# EAGLE design radio (EAGLE 6.4)
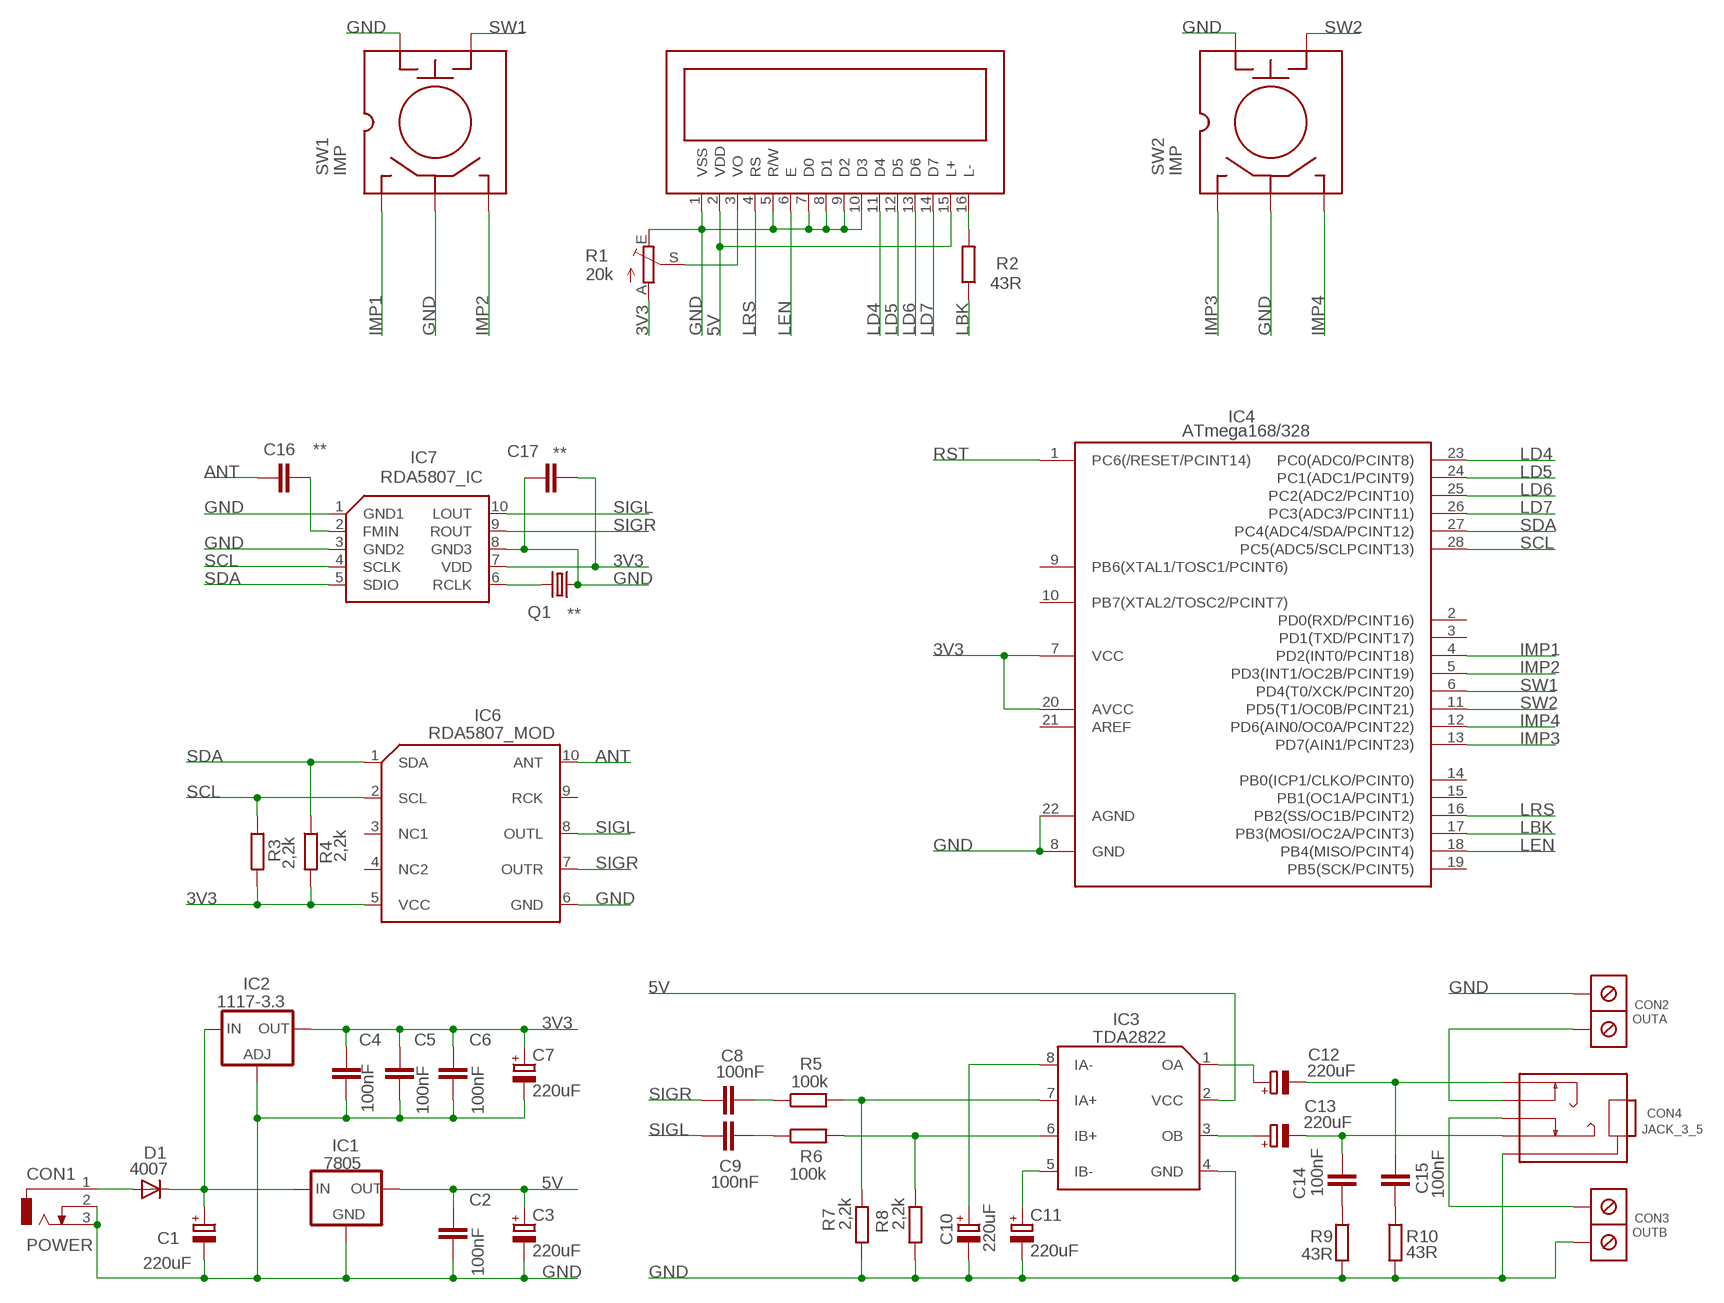
[diagram p0: schematic, sheet 1]

## Parts
C1  220uF  CPOL-EUE2.5-7  [E2,5-7]
C2  100nF  C-EU050-030X075  [C050-030X075]
C3  220uF  CPOL-EUE2.5-7  [E2,5-7]
C4  100nF  C-EU050-030X075  [C050-030X075]
C5  100nF  C-EU050-030X075  [C050-030X075]
C6  100nF  C-EU050-030X075  [C050-030X075]
C7  220uF  CPOL-EUE2.5-7  [E2,5-7]
C8  100nF  C-EU050-030X075  [C050-030X075]
C9  100nF  C-EU050-030X075  [C050-030X075]
C10  220uF  CPOL-EUE2.5-7  [E2,5-7]
C11  220uF  CPOL-EUE2.5-7  [E2,5-7]
C12  220uF  CPOL-EUE2.5-7  [E2,5-7]
C13  220uF  CPOL-EUE2.5-7  [E2,5-7]
C14  100nF  C-EU050-030X075  [C050-030X075]
C15  100nF  C-EU050-030X075  [C050-030X075]
C16  **  C-EUC0805K  [C0805K]
C17  **  C-EUC0805K  [C0805K]
CON1  POWER  DCJ0202  [DCJ0202]
CON2  OUTA  ARK2/300  [ARK2/300]
CON3  OUTB  ARK2/300  [ARK2/300]
CON4  JACK_3_5  [JACK_3_5]
D1  4007  1N4004  [DO41-10]
IC1  7805  78XXS  [78XXS]
IC2  1117-3.3  LM317TS  [317TS]
IC3  TDA2822  [DIL8]
IC4  ATmega168/328  MEGA48/88/168-PU  [DIL28-3]
IC5  LCD16X2  [LCD16X2]
IC6  RDA5807_MOD  [RDA5807_MOD]
IC7  RDA5807_IC  [MSOP10]
Q1  **  CRYSTALTC38H  [TC38H]
R1  20k  TRIM_EU-CA6V  [CA6V]
R2  43R  R-EU_0207/7  [0207/7]
R3  2,2k  R-EU_0207/7  [0207/7]
R4  2,2k  R-EU_0207/7  [0207/7]
R5  100k  R-EU_0207/7  [0207/7]
R6  100k  R-EU_0207/7  [0207/7]
R7  2,2k  R-EU_0207/7  [0207/7]
R8  2,2k  R-EU_0207/7  [0207/7]
R9  43R  R-EU_0207/7  [0207/7]
R10  43R  R-EU_0207/7  [0207/7]
SW1  IMP  [IMP]
SW2  IMP  [IMP]

## Nets
3V3: C4.1 C5.1 C6.1 C7.+ C17.2 IC2.2(OUT) IC4.7(VCC) IC4.20(AVCC) IC6.5(VCC) IC7.7(VDD) R1.A R3.2 R4.2
5V: C2.1 C3.+ IC1.OUT IC3.2(VCC) IC5.2(VDD) IC5.15(L+)
ANT: C16.1 IC6.10(ANT)
GND: C1.- C2.2 C3.- C4.2 C5.2 C6.2 C7.- C10.- C11.- C17.1 CON1.2 CON1.3 CON2.2 CON3.1 CON4.G IC1.GND IC2.1(ADJ) IC3.4(GND) IC4.8(GND) IC4.22(AGND) IC5.1(VSS) IC5.5(R/W) IC5.7(D0) IC5.8(D1) IC5.9(D2) IC5.10(D3) IC6.6(GND) IC7.1(GND1) IC7.3(GND2) IC7.8(GND3) Q1.1 R1.E R7.2 R8.2 R9.2 R10.2 SW1.2 SW1.5 SW2.2 SW2.5
HL: C13.- C14.2 CON4.L
HR: C12.- C15.2 CON4.R
IMP1: IC4.4(PD2(INT0/PCINT18)) SW1.1
IMP2: IC4.5(PD3(INT1/OC2B/PCINT19)) SW1.3
IMP3: IC4.13(PD7(AIN1/PCINT23)) SW2.1
IMP4: IC4.12(PD6(AIN0/OC0A/PCINT22)) SW2.3
LBK: IC4.17(PB3(MOSI/OC2A/PCINT3)) R2.1
LD4: IC4.23(PC0(ADC0/PCINT8)) IC5.11(D4)
LD5: IC4.24(PC1(ADC1/PCINT9)) IC5.12(D5)
LD6: IC4.25(PC2(ADC2/PCINT10)) IC5.13(D6)
LD7: IC4.26(PC3(ADC3/PCINT11)) IC5.14(D7)
LEN: IC4.18(PB4(MISO/PCINT4)) IC5.6(E)
LRS: IC4.16(PB2(SS/OC1B/PCINT2)) IC5.4(RS)
N$1: C14.1 R9.1
N$2: C15.1 R10.1
N$3: IC5.3(VO) R1.S
N$4: CON2.1 CON4.RW
N$5: C12.+ IC3.1(OA)
N$6: IC3.7(IA+) R5.2 R7.1
N$7: IC3.6(IB+) R6.2 R8.1
N$8: C11.+ IC3.5(IB-)
N$9: C10.+ IC3.8(IA-)
N$10: CON3.2 CON4.LW
N$12: C9.2 R6.1
N$13: C8.2 R5.1
N$14: C13.+ IC3.3(OB)
N$15: C1.+ D1.C IC1.IN IC2.3(IN)
N$16: IC7.6(RCLK) Q1.2
N$17: CON1.1 D1.A
N$27: C16.2 IC7.2(FMIN)
N$57: IC5.16(L-) R2.2
RST: IC4.1(PC6(/RESET/PCINT14))
SCL: IC4.28(PC5(ADC5/SCLPCINT13)) IC6.2(SCL) IC7.4(SCLK) R3.1
SDA: IC4.27(PC4(ADC4/SDA/PCINT12)) IC6.1(SDA) IC7.5(SDIO) R4.1
SIGL: C9.1 IC6.8(OUTL) IC7.10(LOUT)
SIGR: C8.1 IC6.7(OUTR) IC7.9(ROUT)
SW1: IC4.6(PD4(T0/XCK/PCINT20)) SW1.4
SW2: IC4.11(PD5(T1/OC0B/PCINT21)) SW2.4
Unconnected: IC4.2(PD0(RXD/PCINT16)) IC4.3(PD1(TXD/PCINT17)) IC4.9(PB6(XTAL1/TOSC1/PCINT6)) IC4.10(PB7(XTAL2/TOSC2/PCINT7)) IC4.14(PB0(ICP1/CLKO/PCINT0)) IC4.15(PB1(OC1A/PCINT1)) IC4.19(PB5(SCK/PCINT5)) IC4.21(AREF) IC6.3(NC1) IC6.4(NC2) IC6.9(RCK)

## Library data of the parts
C1 C3 C7 C10-C13 = rcl:CPOL-EU: POLARIZED CAPACITOR, European symbol
C2 C4-C6 C8 C9 C14-C17 = rcl:C-EU: CAPACITOR, European symbol
CON1 = con-jack:DCJ0202: DC POWER JACK Source: DCJ0202.pdf; OC_FARNELL: unknown; OC_NEWARK: unknown
CON2 CON3 = ds_lib_eagle:ARK2/300
CON4 = Jacki:JACK_3_5
D1 = diode:1N4004: DIODE general purpose rectifier, 1 A
IC1 = v-reg:78XXS: VOLTAGE REGULATOR
IC2 = v-reg:LM317TS: VOLTAGE REGULATOR
IC3 = tda2822:TDA2822
IC4 = avr-7:MEGA48/88/168-PU
IC5 = dslib_eagle 9:LCD16X2
IC6 = radio:RDA5807_MOD
IC7 = radio:RDA5807_IC
Q1 = crystal:CRYSTAL: CRYSTAL; OC_FARNELL: unknown; OC_NEWARK: unknown
R1 = pot:TRIM_EU-: POTENTIOMETER
R2-R10 = rcl:R-EU_: RESISTOR, European symbol
SW1 SW2 = dslib_eagle 9:IMP

## Board
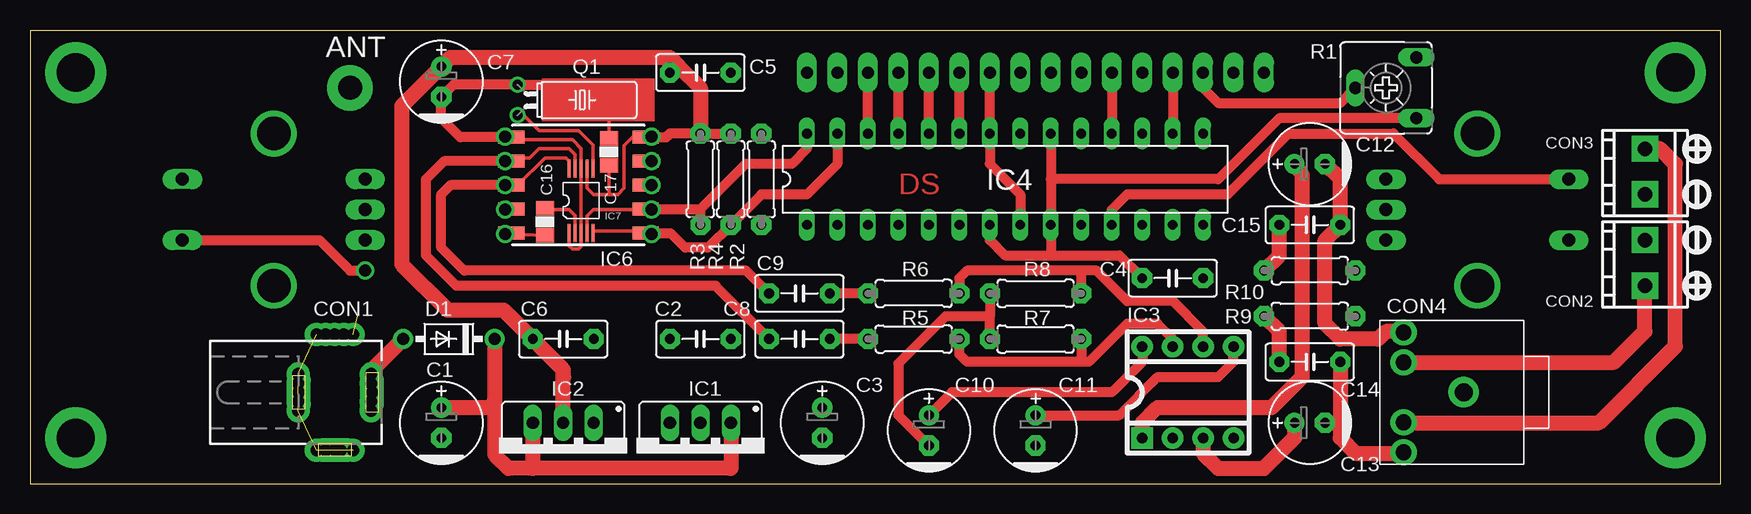
[diagram p1: board, top side]
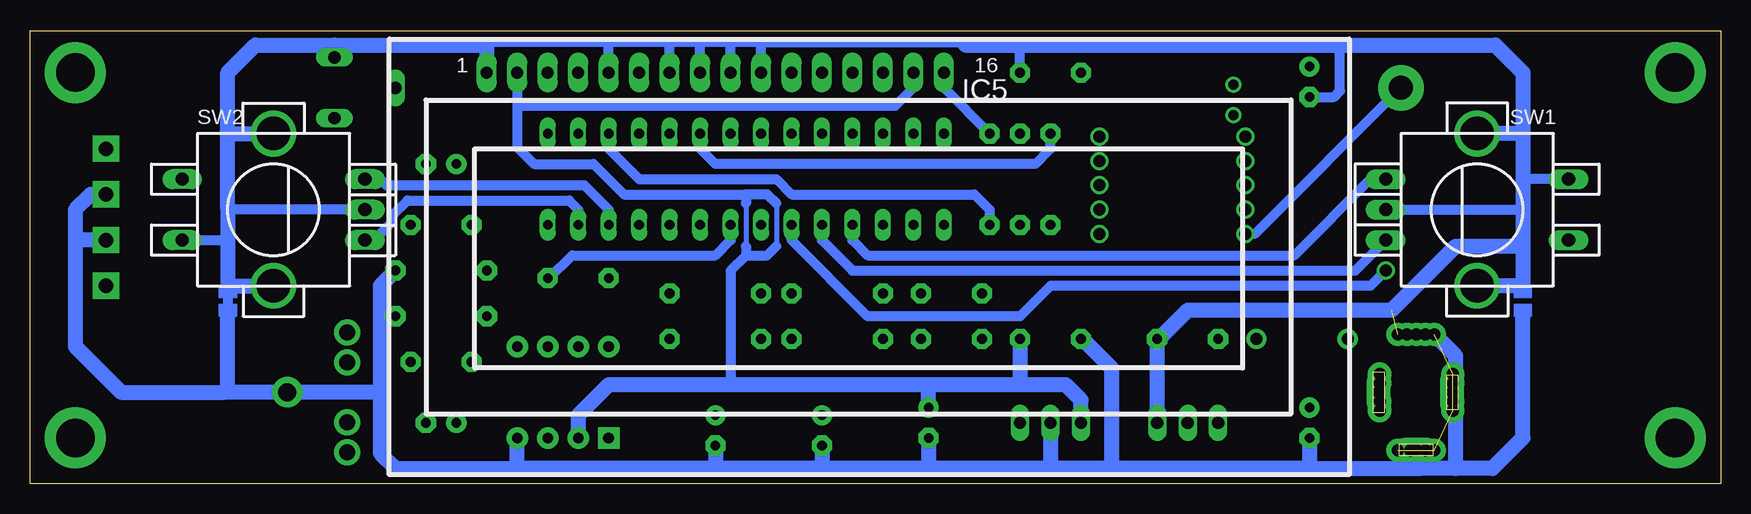
[diagram p2: board, bottom side, seen from below]

Size 140.95 x 37.77 mm. Coordinates in mm from the lower left corner, seen from the top.
Outline: 0,0 140.95,0 140.95,37.77 0,37.77 0,0
Copper layers (1*16): Top 0.035mm / dielectric 1.5mm / Bottom 0.035mm
Design rules "default": minimum track width 10mil, minimum drill 24mil, track to track 8mil, track to pad 8mil, pad to pad 8mil, via to via 8mil, smd to smd 8mil, copper to edge 40mil, drill to drill 8mil, minimum pad ring 10mil, minimum via ring 8mil, stop-mask expansion 4mil, vias tented up to drill 0mil, thermal gap 10mil

### Footprints (pad centres in the part's own frame; a part is rotated, then mirrored left to right if it is on the bottom)
E2,5-7 = drill 0.813 pad 1.676: + -1.27,0 | drill 0.813 pad 1.676 octagon: - 1.27,0
C050-030X075 = drill 0.813 pad 1.676 octagon: 1 -2.54,0; 2 2.54,0
C0805K = smd 1.219 x 1.499: 1 -1.127,0; 2 1.127,0
DCJ0202 = drill 1 pad 2 long: 1 0,3.1; 2 4.8,0; 3 0,-3
ARK2/300 = drill 1.2 pad 2.184 square: 1 -2.54,0; 2 1.27,0
JACK_3_5 = drill 1.5 pad 2.54: G -1.4,0 | drill 1.3 pad 2.2: L 3.6,5; LW 3.6,2.5; R 3.6,-5; RW 3.6,-2.5
DO41-10 = drill 1 pad 1.676: A 3.81,0; C -3.81,0
78XXS = drill 1.016 long: GND 0,-2.54; IN -2.54,-2.54; OUT 2.54,-2.54
317TS = drill 1.016 long: 1 -2.54,-2.54; 2 0,-2.54; 3 2.54,-2.54
DIL8 = drill 0.9 pad 1.778 square: 1 -3.81,-3.81 | drill 0.9 pad 1.778: 2 -1.27,-3.81; 3 1.27,-3.81; 4 3.81,-3.81; 5 3.81,3.81; 6 1.27,3.81; 7 -1.27,3.81; 8 -3.81,3.81
DIL28-3 = drill 0.813 long: 1 -16.51,-3.81; 2 -13.97,-3.81; 3 -11.43,-3.81; 4 -8.89,-3.81; 5 -6.35,-3.81; 6 -3.81,-3.81; 7 -1.27,-3.81; 8 1.27,-3.81; 9 3.81,-3.81; 10 6.35,-3.81; 11 8.89,-3.81; 12 11.43,-3.81; 13 13.97,-3.81; 14 16.51,-3.81; 15 16.51,3.81; 16 13.97,3.81; 17 11.43,3.81; 18 8.89,3.81; 19 6.35,3.81; 20 3.81,3.81; 21 1.27,3.81; 22 -1.27,3.81; 23 -3.81,3.81; 24 -6.35,3.81; 25 -8.89,3.81; 26 -11.43,3.81; 27 -13.97,3.81; 28 -16.51,3.81
LCD16X2 = drill 1 pad 1.676 long: 1 -15.24,6.35; 2 -12.7,6.35; 3 -10.16,6.35; 4 -7.62,6.35; 5 -5.08,6.35; 6 -2.54,6.35; 7 0,6.35; 8 2.54,6.35; 9 5.08,6.35; 10 7.62,6.35; 11 10.16,6.35; 12 12.7,6.35; 13 15.24,6.35; 14 17.78,6.35; 15 20.32,6.35; 16 22.86,6.35
RDA5807_MOD = smd 2.184 x 1.067: 1 -5.6,4.5; 2 -5.6,2.5; 3 -5.6,0.5; 4 -5.6,-1.5; 5 -5.6,-3.5; 6 5.6,-3.5; 7 5.6,-1.5; 8 5.6,0.5; 9 5.6,2.5; 10 5.6,4.5
MSOP10 = smd 0.25 x 1.5: 1 -0.77,-2.47; 2 -0.27,-2.47; 3 0.23,-2.47; 4 0.73,-2.47; 5 1.23,-2.47; 6 1.23,2.93; 7 0.73,2.93; 8 0.23,2.93; 9 -0.27,2.93; 10 -0.77,2.93
TC38H = drill 0.813: 1 -1.27,0; 2 1.27,0
CA6V = drill 1.016 long: A -2.54,-2.54; E 2.54,-2.54; S 0,2.54
0207/7 = drill 0.813 pad 1.676 octagon: 1 -3.81,0; 2 3.81,0
IMP = drill 1.1 long: 1 -2.54,-7.62; 2 0,-7.62; 3 2.54,-7.62; 4 2.54,7.62; 5 -2.54,7.62 | drill 2.8: P$6 -6.35,0; P$7 6.35,0

### Placement (x,y rotation side)
C1  34.29,5.08 270 top
C2  55.88,12.06 180 top
C3  66.04,5.08 270 top
C4  95.25,17.14 0 top
C5  55.88,34.29 0 top
C6  44.45,12.06 0 top
C7  34.29,33.53 270 top
C8  64.14,12.06 0 top
C9  64.14,15.87 0 top
C10  74.93,4.45 270 top
C11  83.82,4.45 270 top
C12  106.68,26.67 0 top
C13  106.68,5.08 0 top
C14  106.68,10.16 0 top
C15  106.68,21.59 0 top
C16  42.93,21.84 90 top
C17  48.26,27.69 270 top
CON1  25.4,7.62 270 top
CON2  134.62,19.05 90 top
CON3  134.62,26.67 90 top
CON4  118.11,7.62 180 top
D1  34.92,12.06 180 top
IC1  55.88,2.54 180 top
IC2  44.45,2.54 180 top
IC3  96.52,7.62 0 top
IC4  81.28,25.4 0 top
IC5  87.63,27.94 0 bottom
IC6  45.72,25.4 180 top
IC7  45.72,23.37 0 top
Q1  40.64,32 270 top
R1  113.03,33.02 90 top
R2  60.96,25.4 90 top
R3  55.88,25.4 90 top
R4  58.42,25.4 90 top
R5  73.66,12.06 0 top
R6  73.66,15.87 0 top
R7  83.82,12.06 180 top
R8  83.82,15.87 180 top
R9  106.68,13.97 0 top
R10  106.68,17.78 0 top
SW1  20.32,22.86 270 bottom
SW2  120.65,22.86 90 bottom

### Tracks (layer width: path | path; a pad name or v marks a point on that pad's centre or on a via)
3V3
  Top 0.305: IC7.7 46.45,24.67 46.99,24.13 48.26,24.13 | 51.26,28.96 IC6.5 50.24,28.9 49.53,28.19 49.53,24.64 49.02,24.13 48.26,24.13 | C17.2 48.26,24.13
  Top 0.813: C4.1 90.8,19.05 85.09,19.05 | IC4.20 85.09,25.4 | R1.A 104.14,30.48 99.06,25.4 85.09,25.4 | IC6.5 53.03,28.9 53.34,29.21 R3.2 R4.2 | 44.7,8.89 44.45,9.14 | IC4.7 80.01,20.32 81.28,19.05 85.09,19.05 | 85.09,25.4 85.09,19.05
  Top 1.27: IC2.2 44.45,9.14 44.45,9.53 C6.1 39.5,14.48 34.8,14.48 30.99,18.29 30.99,31.5 C7.+ 35.05,35.56 53.34,35.56 54.1,34.8 | 54.1,34.8 53.34,34.8 C5.1 | 54.1,34.8 55.88,33.02 R3.2
  Bottom 0.813: IC4.20 85.09,27.94 83.82,26.67 57.15,26.67 55.88,27.94 R3.2
5V
  Bottom 0.406: 78.74,23.37 78.74,19.81 | 81.28,23.37 81.28,19.81
  Bottom 0.813: IC5.2 100.33,31.5 | 100.33,31.5 100.33,28.07 98.93,26.67 93.98,26.67 91.44,24.13 81.28,24.13 | 78.74,23.37 79.5,24.13 81.28,24.13 | 81.28,24.13 81.28,23.37 | 81.28,19.81 81.28,19.05 | 81.28,19.05 82.55,17.78 82.55,8.25 | 81.28,19.05 79.5,19.05 78.74,19.81 | IC5.15 67.31,33.02 68.83,31.5 100.33,31.5
  Bottom 1.27: IC1.OUT 53.34,6.98 54.61,8.25 58.42,8.25 | 58.42,8.25 66.04,8.25 | 66.04,8.25 82.55,8.25 92.71,8.25 95.25,5.71 IC3.2 | C3.+ 66.04,8.25 | C2.1 58.42,8.25
ANT  (via drill 1, 2 pad 3.81)
  Top 0.305: 39.81,21.08 39.62,20.9 | C16.1 40.18,20.84 IC6.10
  Top 0.813: IC6.10 39.62,20.9 39.55,20.83 v39.62,20.83
  Bottom 0.813: v26.67,33.02 38.86,20.83 v39.62,20.83
GND  (1 unrouted)
  Top 0.305: IC6.6 40.32,28.7 45.21,28.7 45.95,27.96 IC7.8 IC7.3 45.95,19.79 45.72,19.56 45.21,19.56 44.95,19.82 IC7.1 | C17.1 48.26,33.27
  Top 0.813: IC5.10 IC4.22 80.01,26.67 82.55,24.13 IC4.8 | R7.2 80.01,13.97 | 80.01,13.97 76.33,13.97 72.39,10.03 72.39,5.71 C10.- | R8.2 80.01,13.97 | IC6.6 35.87,28.9 34.29,30.48 C7.- 35.31,33.27 Q1.1 48.26,33.27
  Bottom 0.813: 80.01,36.83 82.55,36.83 | 82.55,36.83 85.09,36.83 | 85.09,36.83 87.63,36.83 | 87.63,36.83 92.71,36.83 | 92.71,36.83 102.87,36.83 102.87,36.58 | IC5.5 92.71,36.83 | IC5.9 82.55,36.83 | IC5.8 85.09,36.83 | IC5.7 87.63,36.83 | IC5.10 80.01,36.83 | 80.01,36.83 62.99,36.83 62.99,36.58 | SW2.2 124.46,22.86 | R1.E 115.57,36.58 | SW1.5 16.51,25.4 | SW1.2 16.51,22.86 | SW2.5 124.46,20.32 | C5.2 58.42,36.32 58.67,36.58 | C4.2 97.66,17.14 95.76,19.05 83.82,19.05 82.55,20.32 IC4.8 | C7.- 32.26,32.26 31.75,32.77 31.75,36.32 32,36.58
  Bottom 1.27: 34.29,1.27 50.8,1.27 | 50.8,1.27 55.88,1.27 | 55.88,1.27 66.04,1.27 | 66.04,1.27 74.93,1.27 | 74.93,1.27 83.82,1.27 | 83.82,1.27 100.33,1.27 | 100.33,1.27 IC3.4 | C10.- 74.93,1.27 | C3.- 66.04,1.27 | C1.- 34.29,1.27 | 34.29,1.27 25.4,1.27 25.4,1.52 | CON1.2 25.4,1.52 | IC1.GND 55.88,1.27 | 100.33,1.27 110.49,1.27 111.76,2.54 111.76,7.62 | R9.2 111.76,13.97 | 111.76,13.97 111.76,7.62 | R10.2 111.76,16.51 111.76,13.97 | 83.82,3.3 C11.- 83.82,1.27 | 22.1,1.27 22.1,7.62 | 22.1,7.62 22.1,10.67 23.88,12.45 26.92,12.45 | CON1.3 22.1,7.62 | IC5.1 102.87,36.58 115.57,36.58 122.17,36.58 124.46,34.29 124.46,29.21 | 124.46,29.21 124.46,22.86 124.46,20.32 124.46,16.51 121.92,16.51 | CON2.2 136.91,20.32 | 136.91,20.32 137.16,20.32 137.16,11.43 133.35,7.62 124.71,7.62 124.46,7.87 | CON3.1 135.89,24.13 137.16,22.86 137.16,20.57 136.91,20.32 | 62.99,36.58 58.67,36.58 32,36.58 18.8,36.58 16.51,34.29 16.51,29.21 | 16.51,29.21 16.51,25.4 16.51,22.86 16.51,20.07 | 22.1,1.27 19.05,1.27 16.51,3.81 16.51,13.97 | 22.1,1.27 25.15,1.27 25.4,1.52 | C2.2 53.21,12.06 50.8,9.65 50.8,1.27 | 111.76,7.62 CON4.G | CON4.G 124.46,7.62 124.46,7.87 | 124.46,7.87 124.46,13.97 | 119.38,7.49 CON4.G | 16.51,20.07 16.51,16.51 19.05,16.51 | IC2.1 C6.2 46.86,12.06 44.45,14.48 27.43,14.48 22.1,19.81 16.76,19.81 16.51,20.07 | 16.51,29.21 18.8,29.21 | 124.46,29.21 121.92,29.21
HL
  Top 1.27: C14.2 109.22,5.08 | 109.22,5.08 109.22,3.81 110.49,2.54 114.43,2.54 CON4.L | C13.- 109.22,5.08
HR
  Top 1.27: C12.- 109.22,25.4 C15.2 107.95,20.32 107.95,13.33 109.22,12.06 112.39,12.06 113.03,12.7 114.43,12.7 CON4.R
IMP1
  Bottom 0.813: IC4.4 72.39,20.32 71.12,19.05 35.56,19.05 29.21,25.4 SW1.1
IMP2
  Bottom 0.813: IC4.5 74.93,20.32 72.39,17.78 30.48,17.78 SW1.3
IMP3
  Bottom 0.813: SW2.1 112.27,20.32 110.74,21.84 110.74,22.35 109.47,23.62 96.01,23.62 95.25,22.86 IC4.13
IMP4
  Bottom 0.813: SW2.3 111.76,25.4 111.25,24.89 94.74,24.89 92.71,22.86 IC4.12
LBK
  Bottom 0.813: IC4.17 92.71,27.94 90.17,25.4 78.74,25.4 77.47,24.13 62.23,24.13 60.96,22.86 R2.1
LD4
  Top 0.813: IC4.23 IC5.11
LD5
  Top 0.813: IC4.24 IC5.12
LD6
  Top 0.813: IC4.25 IC5.13
LD7
  Top 0.813: IC4.26 IC5.14
LEN
  Top 0.813: IC5.6 IC4.18
LRS
  Top 0.813: IC5.4 IC4.16
N$1
  Top 1.27: C14.1 104.14,12.7 R9.1
N$2
  Top 1.27: R10.1 104.14,19.05 C15.1
N$3
  Top 0.813: IC5.3 97.79,33.02 99.06,31.75 109.22,31.75 R1.S
N$4
  Top 1.27: CON4.RW 132.04,10.12 134.62,12.7 CON2.1
N$5
  Top 1.27: C12.+ 106.05,25.78 106.05,8.89 103.5,6.35 93.98,6.35 92.71,5.08 IC3.1
N$6
  Top 0.813: IC3.7 95.25,12.06 93.98,13.33 91.44,13.33 88.27,10.16 87.63,10.16 | 87.63,10.16 78.11,10.16 77.47,10.79 R5.2 | R7.1 87.63,10.16
N$7
  Top 0.813: 87.63,17.78 88.9,17.78 91.44,15.24 95.25,15.24 97.79,12.7 IC3.6 | 87.63,17.78 78.11,17.78 77.47,17.14 R6.2 | R8.1 87.63,17.78
N$8
  Top 0.813: IC3.5 100.33,10.16 99.06,8.89 93.98,8.89 90.8,5.71 C11.+
N$9
  Top 0.813: IC3.8 92.71,10.16 90.17,7.62 76.83,7.62 C10.+
N$10
  Top 1.27: CON4.LW 114.55,5.08 130.81,5.08 137.16,11.43 137.16,26.67 135.89,27.94 CON3.2
N$11
  Bottom 0.813: 124.46,16.26 124.46,14.22
N$12
  Top 0.813: R6.1 C9.2
N$13
  Top 0.813: R5.1 C8.2
N$14
  Top 1.27: IC3.3 97.79,2.54 99.06,1.27 102.87,1.27 105.41,3.81 C13.+
N$15
  Top 1.27: IC1.IN 58.42,1.27 41.91,1.27 | 41.91,1.27 39.88,1.27 38.73,2.41 38.73,6.98 | IC2.3 41.91,1.27 | D1.C 38.73,6.98 | C1.+ 38.61,6.35 38.73,6.98
N$16
  Top 0.305: IC7.6 46.95,28.23 45.72,29.46 42.42,29.46 41.15,30.73 Q1.2
N$17
  Top 1.27: D1.A 28.58,9.53 28.58,7.7 CON1.1
N$18  (via drill 1 pad 1.93)
  other vias: 25.4,12.45
N$19  (via drill 1 pad 1.93)
  other vias: 26.16,12.45
N$20  (via drill 1 pad 1.93)
  other vias: 24.64,12.45
N$21  (via drill 1 pad 1.93)  (8 unrouted)
  other vias: 23.88,12.45 24.64,2.79 25.91,2.79 26.92,2.79 23.88,2.79 22.35,8.38 22.35,9.14 22.35,6.86 22.35,6.1
N$22  (via drill 1 pad 1.93)
  other vias: 26.92,12.45
N$23  (via drill 1 pad 1.93)
  other vias: 28.45,8.38
N$24  (via drill 1 pad 1.93)
  other vias: 28.45,9.14
N$25  (via drill 1 pad 1.93)
  other vias: 28.45,6.86
N$26  (via drill 1 pad 1.93)
  other vias: 28.45,6.1
N$27
  Top 0.305: IC7.2 45.45,22.37 44.96,22.86 42.94,22.86 C16.2
N$28  (via drill 1)
  other vias: 39.62,22.86
N$29  (via drill 1)
  other vias: 39.62,24.89
N$30  (via drill 1)
  other vias: 39.62,26.92
N$31  (via drill 1)
  other vias: 39.62,28.96
N$32  (via drill 1)
  other vias: 51.82,28.96
N$33  (via drill 1)
  other vias: 51.82,26.92
N$34  (via drill 1)
  other vias: 51.82,24.89
N$35  (via drill 1)
  other vias: 51.82,22.86
N$36  (via drill 1)
  other vias: 51.82,20.83
N$37  (via drill 3.2 pad 5.08)
  other vias: 3.81,34.29
N$38  (via drill 3.2 pad 5.08)
  other vias: 3.81,3.81
N$39  (via drill 3.2 pad 5.08)
  other vias: 137.16,3.81
N$40  (via drill 3.2 pad 5.08)
  other vias: 137.16,34.29
N$57
  Bottom 0.813: IC5.16 64.77,33.02 R2.2
SCL
  Top 0.305: IC7.4 46.45,22.32 46.99,22.86 51.28,22.86 IC6.2
  Top 0.813: IC6.2 55.88,22.9 | 55.88,22.9 55.92,22.9 | R3.1 55.88,22.9 | IC4.28 64.77,27.94 63.5,26.67 59.65,26.67 55.88,22.9
SDA
  Top 0.305: IC7.5 46.95,21.04 46.99,21.08 51.14,21.08 IC6.1
  Top 0.813: IC4.27 67.31,26.67 64.77,24.13 60.96,24.13 R4.1 56.52,19.69 54.61,19.69 53.39,20.9 IC6.1
SIGL
  Top 0.305: IC6.8 40.65,24.9 42.93,27.18 44.7,27.18 44.95,26.92 IC7.10
  Top 0.813: IC6.8 35.06,24.9 34.29,24.13 34.29,19.69 36.2,17.78 59.69,17.78 C9.1
SIGR
  Top 0.305: IC7.9 45.45,27.45 44.96,27.94 42.42,27.94 41.66,27.18 40.4,27.18 IC6.7
  Top 0.813: IC6.7 34.52,26.9 33.02,25.4 33.02,19.05 35.56,16.51 57.15,16.51 C8.1
SW1  (via drill 1)
  Top 0.813: SW1.4 24.13,20.32 26.67,17.78 v27.94,17.78
  Bottom 0.813: v27.94,17.78 29.21,16.51 55.88,16.51 58.42,13.97 71.12,13.97 77.47,20.32 IC4.6
SW2
  Top 0.813: IC4.11 90.17,22.86 91.44,24.13 99.82,24.13 104.9,29.21 113.66,29.21 117.47,25.4 SW2.4
(copper drawn outside any net)
  shapes: Bottom area x4, Top area x1

### Text on the board
Top: DS
tPlace: ANT